# Altium schematic sheet LTC7818.SchDoc
size A4; DrawnBy: 空话; Organization: GLUT机器人创新实践基地; Address1: 中国; Address2: 广西; Address3: 桂林; Address4: 雁山; SheetNumber: 1; SheetTotal: 1
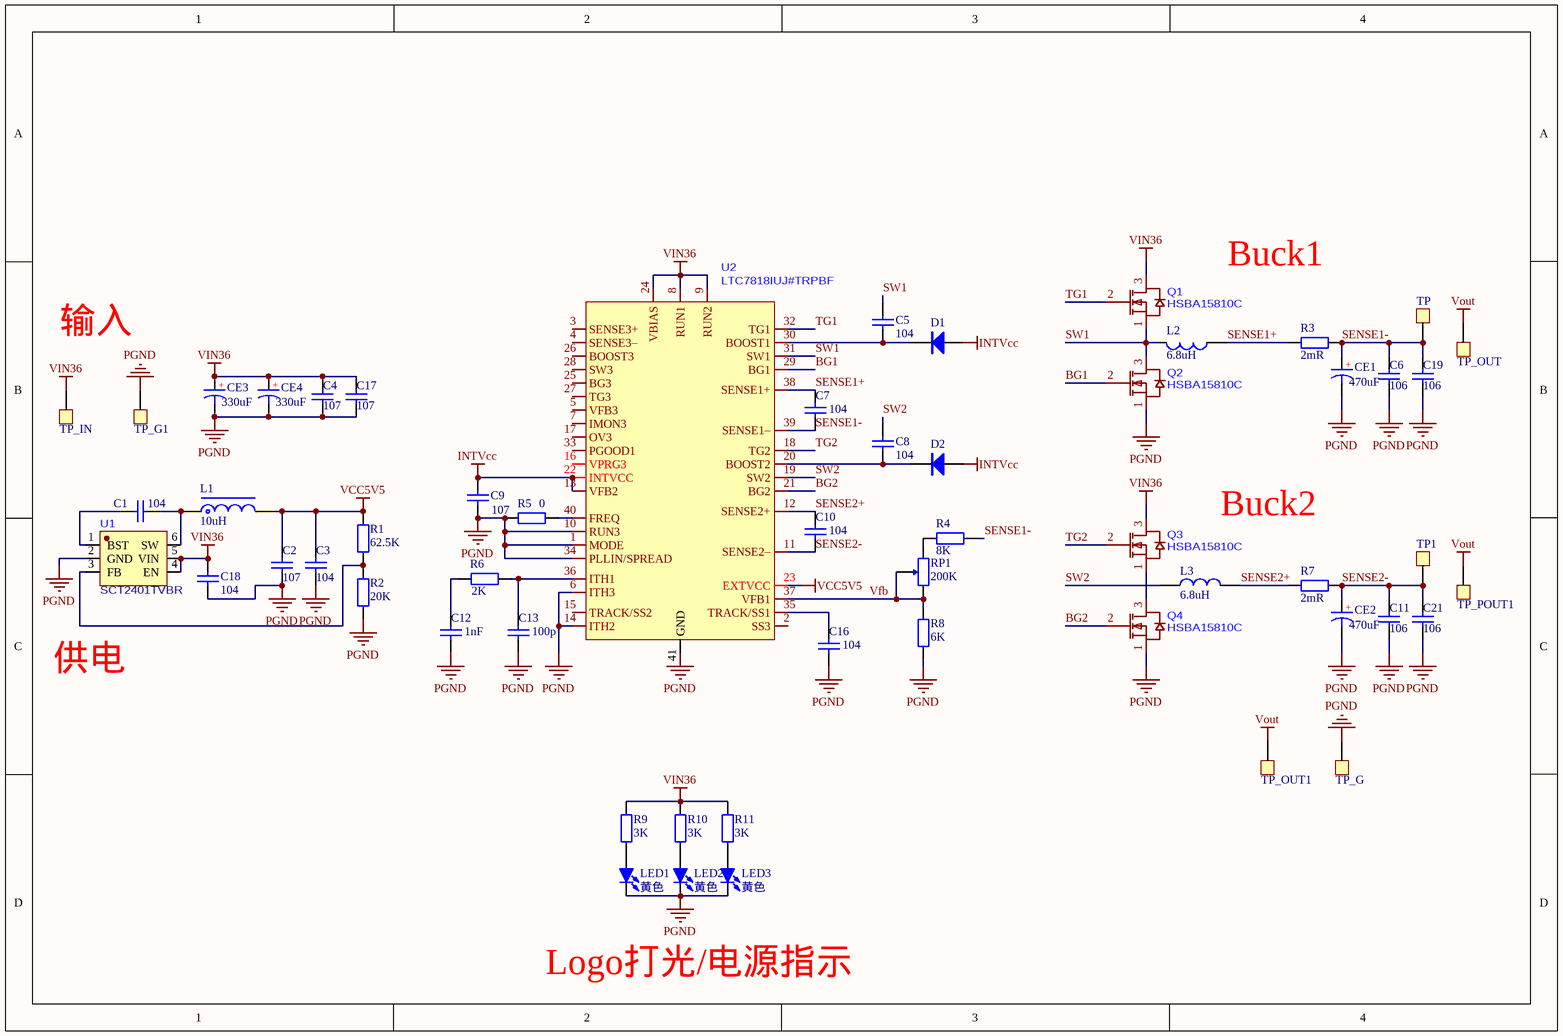
[diagram p0: LTC7818.SchDoc]

## Parts
C1  104  [C0603_M]
C2  107  [C0603_M]
C3  104  [C0402_M]
C4  107  [C1210_M]
C5  104  [C0402_M]
C6  106  [C1210_M]
C7  104  [C0402_M]
C8  104  [C0402_M]
C9  107  [C0603_M]
C10  104  [C0402_M]
C11  106  [C1210_M]
C12  1nF  [C0603_M]
C13  100p  [C0603_M]
C16  104  [C0402_M]
C17  107  [C1210_M]
C18  104  [C0603_M]
C19  106  [C1210_M]
C21  106  [C1210_M]
CE1  470uF  [CAP 5.0*10*12.5]
CE2  470uF  [CAP 5.0*10*12.5]
CE3  330uF  [CAP 5.0*10*12.5]
CE4  330uF  [CAP 5.0*10*12.5]
D1  (no value)  [SOD-323]
D2  (no value)  [SOD-323]
L1  10uH  [L-SMD-0630]
L2  6.8uH  [L_ SER2900]
L3  6.8uH  [L_ SER2900]
LED1  黄色  [LED0603_R]
LED2  黄色  [LED0603_R]
LED3  黄色  [LED0603_R]
Q1  HSBA15810C  [PQFN-8_L6.0-W5.0-P1.27-LS6.0-BL]
Q2  HSBA15810C  [PQFN-8_L6.0-W5.0-P1.27-LS6.0-BL]
Q3  HSBA15810C  [PQFN-8_L6.0-W5.0-P1.27-LS6.0-BL]
Q4  HSBA15810C  [PQFN-8_L6.0-W5.0-P1.27-LS6.0-BL]
R1  62.5K  [R0603_M]
R2  20K  [R0603_M]
R3  2mR  [R2512_M]
R4  8K  [R0603_M]
R5  0  [R0603_M]
R6  2K  [R0603_M]
R7  2mR  [R2512_M]
R8  6K  [R0603_M]
R9  3K  [R0603_M]
R10  3K  [R0603_M]
R11  3K  [R0603_M]
RP1  200K  [3296W]
TP  TP  [CONN-TH_T44001]  (value not drawn)
TP1  TP  [CONN-TH_T44001]  (value not drawn)
TP_G  TP  [CONN-TH_T44001]  (value not drawn)
TP_G1  TP  [CONN-TH_T44001]  (value not drawn)
TP_IN  TP  [CONN-TH_T44001]  (value not drawn)
TP_OUT  TP  [CONN-TH_T44001]  (value not drawn)
TP_OUT1  TP  [CONN-TH_T44001]  (value not drawn)
TP_POUT1  TP  [CONN-TH_T44001]  (value not drawn)
U1  SCT2401TVBR  [SOT23-6M]
U2  LTC7818IUJ#TRPBF  [QFN40 6X6_M]

## Nets
INTVcc: C9.2 D1.1(A) D2.1(A) U2.13(VFB2) U2.22(INTVCC)
PGND: C2.2 C3.1 C4.1 C6.1 C9.1 C11.1 C12.2 C13.2 C16.2 C17.1 C18.2 C19.1 C21.1 CE1.2 CE2.2 CE3.2 CE4.2 LED1.2(K) LED2.2(K) LED3.2(K) Q2.1(S) Q4.1(S) R2.1 R5.1 R8.1 TP_G.1 TP_G1.1 U1.2(GND) U2.1(MODE) U2.6(ITH3) U2.10(RUN3) U2.14(ITH2) U2.34(PLLIN/SPREAD) U2.41(GND)
VCC5V5: C2.1 C3.2 L1.2 R1.2 U2.23(EXTVCC)
VIN36: C4.2 C17.2 C18.1 CE3.1 CE4.1 Q1.3(D) Q3.3(D) R9.2 R10.2 R11.2 TP_IN.1 U1.4(EN) U1.5(VIN) U2.8(RUN1) U2.9(RUN2) U2.24(VBIAS)
Vout: TP_OUT.1 TP_OUT1.1 TP_POUT1.1
BG1: Q2.2(G) U2.29(BG1)
BG2: Q4.2(G) U2.21(BG2)
SENSE1+: C7.1 L2.1 R3.1 U2.38(SENSE1+)
SENSE1-: C6.2 C7.2 C19.2 CE1.1 R3.2 R4.2 TP.1 U2.39(SENSE1–)
SENSE2+: C10.1 L3.2 R7.1 U2.12(SENSE2+)
SENSE2-: C10.2 C11.2 C21.2 CE2.1 R7.2 TP1.1 U2.11(SENSE2–)
SW1: C5.1 L2.2 Q1.1(S) Q2.3(D) U2.31(SW1)
SW2: C8.1 L3.1 U2.19(SW2)
TG1: Q1.2(G) U2.32(TG1)
TG2: Q3.2(G) U2.18(TG2)
Vfb: R8.2 RP1.1 RP1.2 U2.37(VFB1)
NetC1_1: C1.1 U1.1(BST)
NetC1_2: C1.2 L1.1 U1.6(SW)
NetC5_2: C5.2 D1.2(K) U2.30(BOOST1)
NetC8_2: C8.2 D2.2(K) U2.20(BOOST2)
NetC12_1: C12.1 R6.1
NetC13_1: C13.1 R6.2 U2.36(ITH1)
NetC16_1: C16.1 U2.35(TRACK/SS1)
NetLED1_1: LED1.1(A) R9.1
NetLED2_1: LED2.1(A) R10.1
NetLED3_1: LED3.1(A) R11.1
NetQ3_1: Q3.1(S) Q4.3(D)
NetR1_1: R1.1 R2.2 U1.3(FB)
NetR4_1: R4.1 RP1.3
NetR5_2: R5.2 U2.40(FREQ)

Not connected (* = marked no-connect by the designer): U2 2(SS3) 3(SENSE3+) 4(SENSE3–) 5(VFB3) 7(IMON3) 15(TRACK/SS2) 16(VPRG3) 17(OV3) 25(BG3) 26(BOOST3) 27(TG3) 28(SW3) 33(PGOOD1)

## Notes on the sheet
- Buck1
- 输入
- Buck2
- 供电
- Logo打光/电源指示
- (in symbol CE) +

## Library data of the parts
C1-C13 C16-C19 C21 = C: 贴片电容; BOM名称: 无极性贴片电容; 联系卖家，免费查找封装: 唯一出售店铺网址https://shop463601444.taobao.com; 封装库来自淘宝卖家ID：黄晶宝石: 其他店铺购入均为盗版假冒封装库，请立即申请退款
CE1-CE4 = CE: 直插电解电容; 联系卖家，免费查找封装: 唯一出售店铺网址https://shop463601444.taobao.com; 封装库来自淘宝卖家ID：黄晶宝石: 其他店铺购入均为盗版假冒封装库，请立即申请退款; BOM名称: 直插电解电容
D1 D2 = 1N4148: 开关二极管; BOM名称: 高速开关二极管; 联系卖家，免费查找封装: 唯一出售店铺网址https://shop463601444.taobao.com
L1 = L-Molding Choke: 一体成型电感; 联系卖家，免费查找封装: 唯一出售店铺网址https://shop463601444.taobao.com; 封装库来自淘宝卖家ID：黄晶宝石: 其他店铺购入均为盗版假冒封装库，请立即申请退款; BOM名称: 一体成型电感
L2 L3 = L_ SER2900
LED1-LED3 = LED-SMD: 贴片LED; 封装库来自淘宝卖家 ID：黄晶宝石: 其他店铺购入均为假冒，请立即申请退款，本店奖励现金5~20元; BOM名称: 贴片LED
R1-R11 = R: 贴片电阻; 联系卖家，免费查找封装: 唯一出售店铺网址https://shop463601444.taobao.com; 封装库来自淘宝卖家ID：黄晶宝石: 其他店铺购入均为盗版假冒封装库，请立即申请退款; BOM名称: 贴片电阻
RP1 = RP: 单联电位器; BOM名称: 插件电位器; 联系卖家，免费查找封装: 唯一出售店铺网址https://shop463601444.taobao.com; 封装库来自淘宝卖家ID：黄晶宝石: 其他店铺购入均为盗版假冒封装库，请立即申请退款